# EAGLE design TopPCB (EAGLE 6.3)
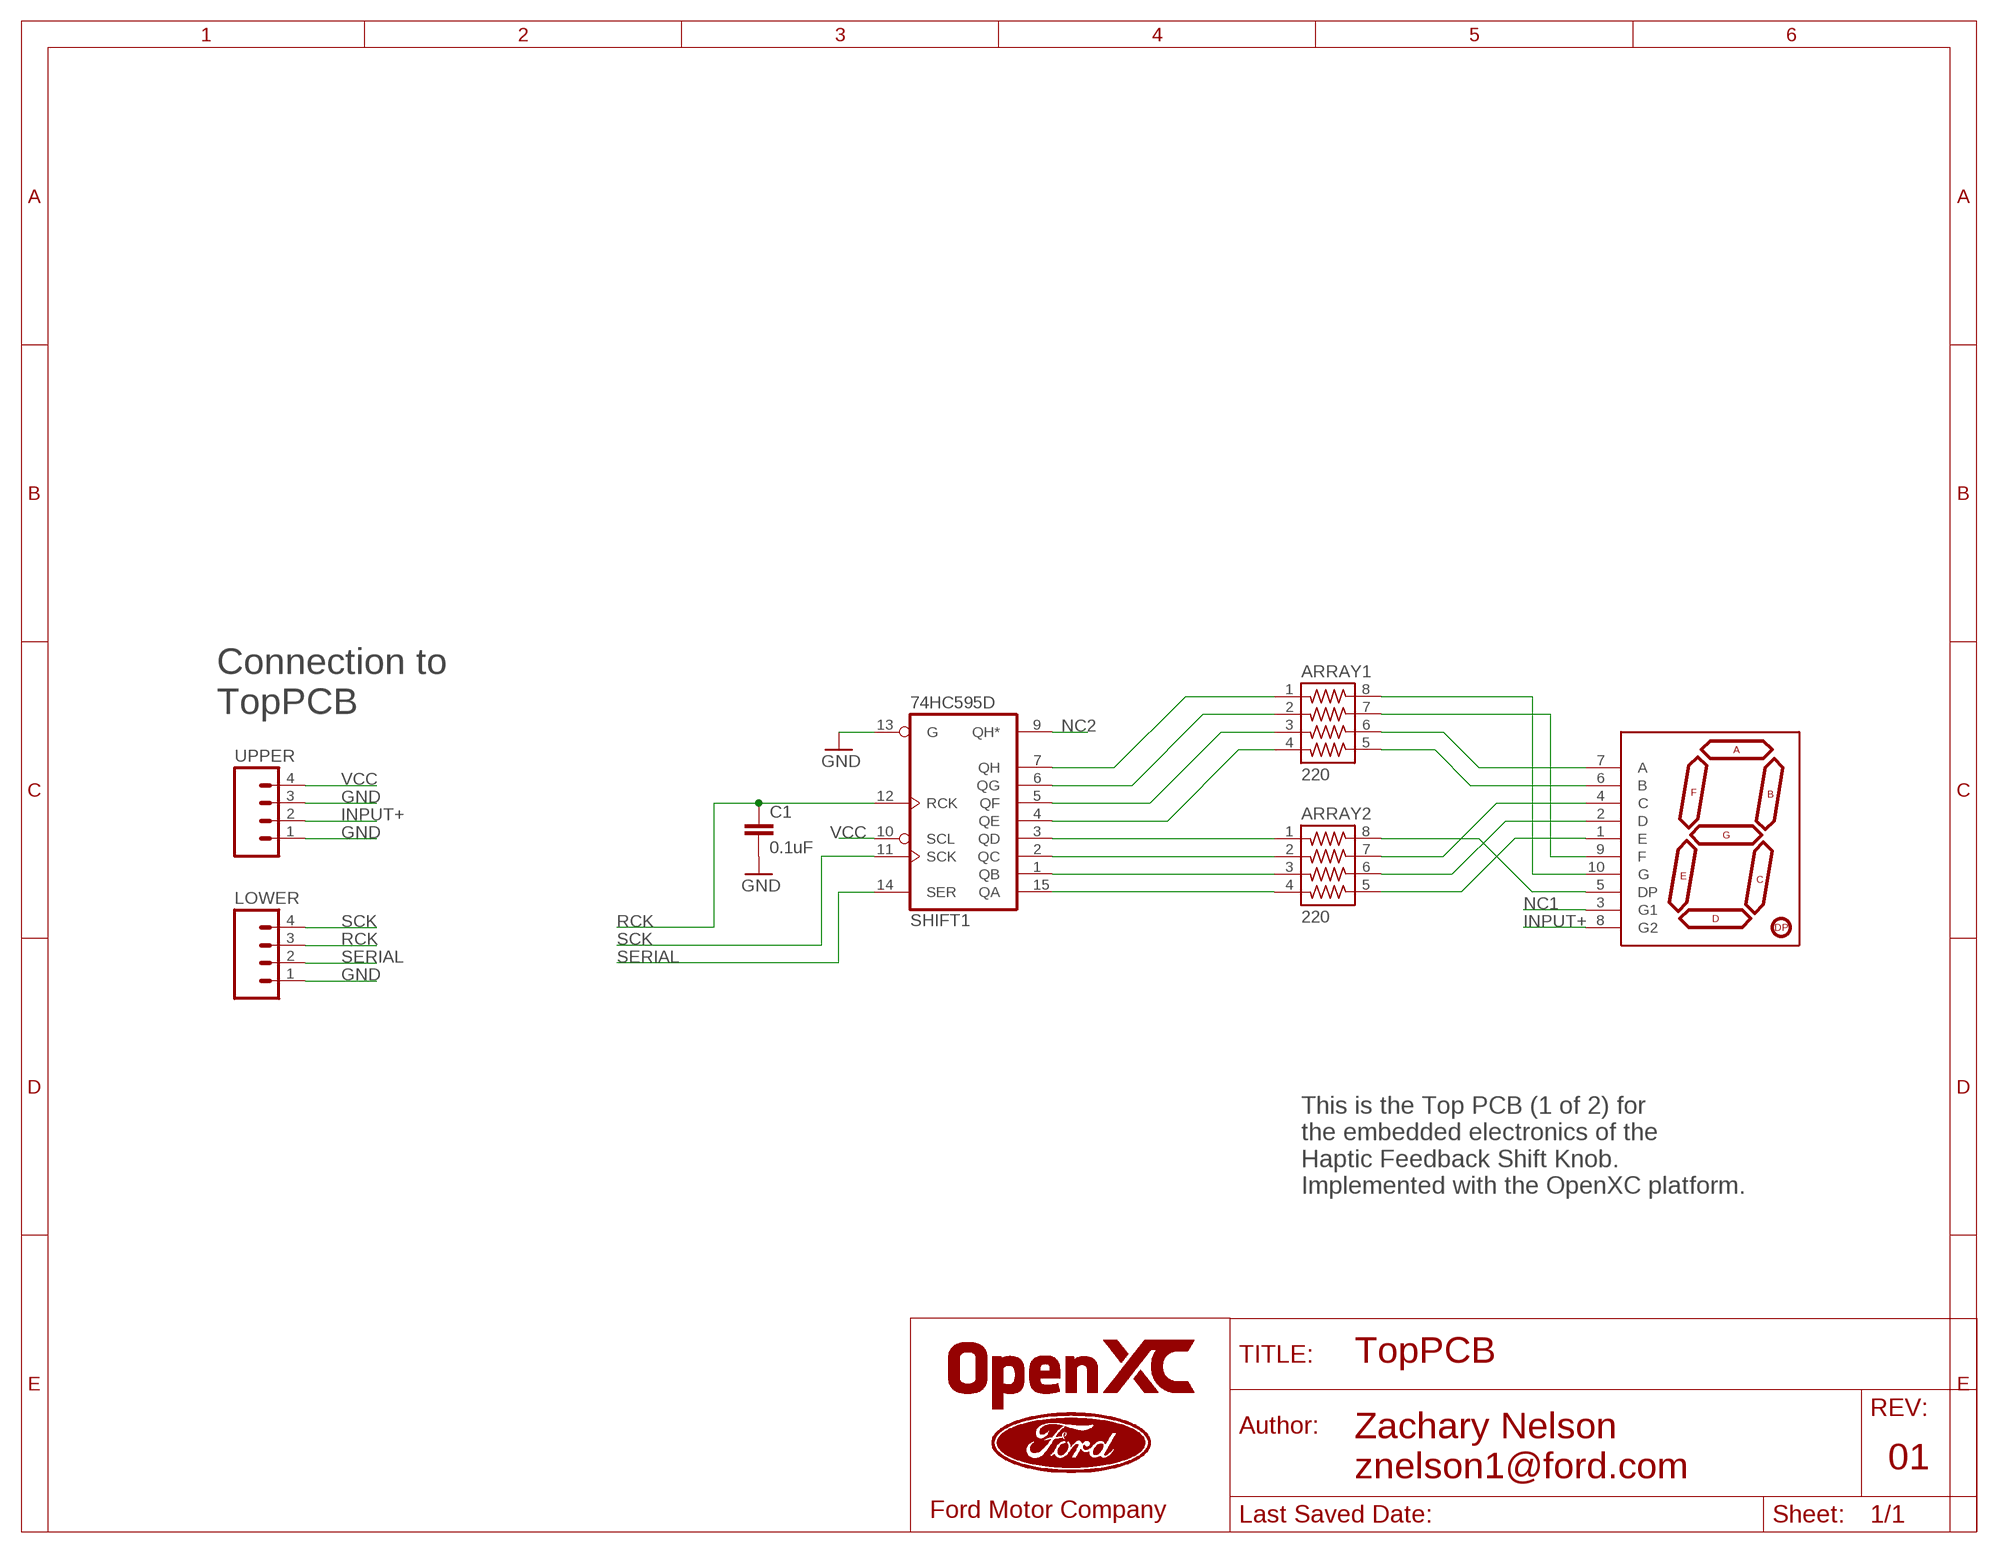
[diagram p0: schematic, sheet 1]

## Parts
7SEGMENT  7-SEGMENT-DISPLAY-1"-RED  [7-SEGMENT-1"PTH]
ARRAY1  220  744-8  [744-8]
ARRAY2  220  744-8  [744-8]
C1  0.1uF  CAP0402-CAP  [0402-CAP]
LOWER  M04PTH  [1X04]
SHIFT1  74HC595D  [SO16]
UPPER  M04PTH  [1X04]

## Nets
GND: C1.2 LOWER.1 SHIFT1.13(G) UPPER.1 UPPER.3
INPUT+: 7SEGMENT.8(G2) UPPER.2
N$1: 7SEGMENT.5(DP) ARRAY2.8
N$2: ARRAY2.3 SHIFT1.1(QB)
N$3: 7SEGMENT.1(E) ARRAY2.5
N$4: ARRAY2.2 SHIFT1.2(QC)
N$5: ARRAY2.1 SHIFT1.3(QD)
N$7: 7SEGMENT.4(C) ARRAY2.7
N$8: 7SEGMENT.6(B) ARRAY1.5
N$9: ARRAY2.4 SHIFT1.15(QA)
N$10: ARRAY1.4 SHIFT1.4(QE)
N$11: ARRAY1.3 SHIFT1.5(QF)
N$12: ARRAY1.2 SHIFT1.6(QG)
N$13: ARRAY1.1 SHIFT1.7(QH)
N$14: 7SEGMENT.7(A) ARRAY1.6
N$15: 7SEGMENT.9(F) ARRAY1.7
N$16: 7SEGMENT.10(G) ARRAY1.8
N$19: 7SEGMENT.2(D) ARRAY2.6
NC1: 7SEGMENT.3(G1)
NC2: SHIFT1.9(QH*)
RCK: C1.1 LOWER.3 SHIFT1.12(RCK)
SCK: LOWER.4 SHIFT1.11(SCK)
SERIAL: LOWER.2 SHIFT1.14(SER)
VCC: SHIFT1.10(SCL) UPPER.4

## Notes on the sheet
- Connection to 
  TopPCB
- This is the Top PCB (1 of 2) for 
  the embedded electronics of the 
  Haptic Feedback Shift Knob. 
  Implemented with the OpenXC platform.
- 01
- Zachary Nelson
  znelson1@ford.com

## Power pins joined to a net without a drawn wire
GND: SHIFT1.8(GND)
VCC: SHIFT1.16(VCC)

## Library data of the parts
7SEGMENT = SparkFun-Displays:7-SEGMENT-DISPLAY-1"-RED: 7-Segment Display 1" Red (COM-08546)
ARRAY1 ARRAY2 = resistor-array:744-8: CTS 744 Series 4 Resistors, 8 Terminations
C1 = SparkFun-Capacitors:CAP: Capacitor Standard 0603 ceramic capacitor, and 0.1" leaded capacitor.
LOWER UPPER = SparkFun-Connectors:M04: Header 4 Standard 4-pin 0.1" header. Use with straight break away headers (SKU : PRT-00116), right angle break away headers (PRT-00553), swiss pins (PRT-00743), machine pins (PRT-00117), and female headers (PRT-00115). Molex polarized connector foot print use with SKU : PRT-08231 with associated crimp pins and housings. 1MM SMD Version SKU: PRT-10208
SHIFT1 = 74xx-eu:74*595: 8-bit SHIFT REGISTER, output latch

## Board
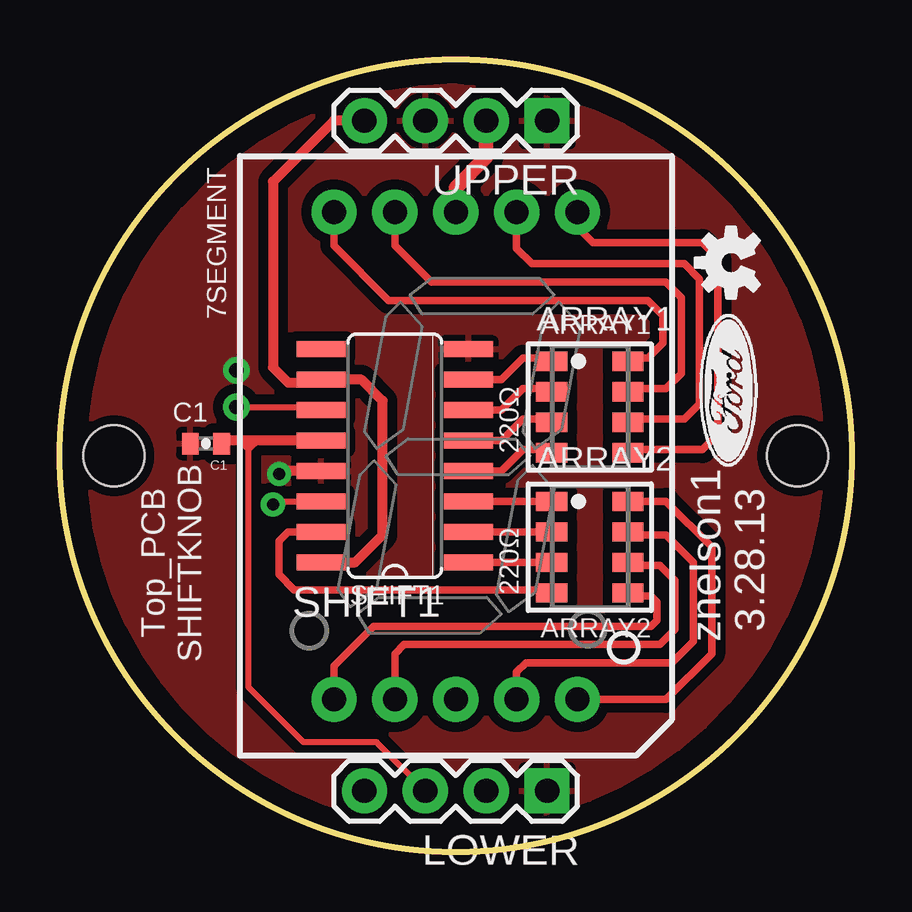
[diagram p1: board, top side]
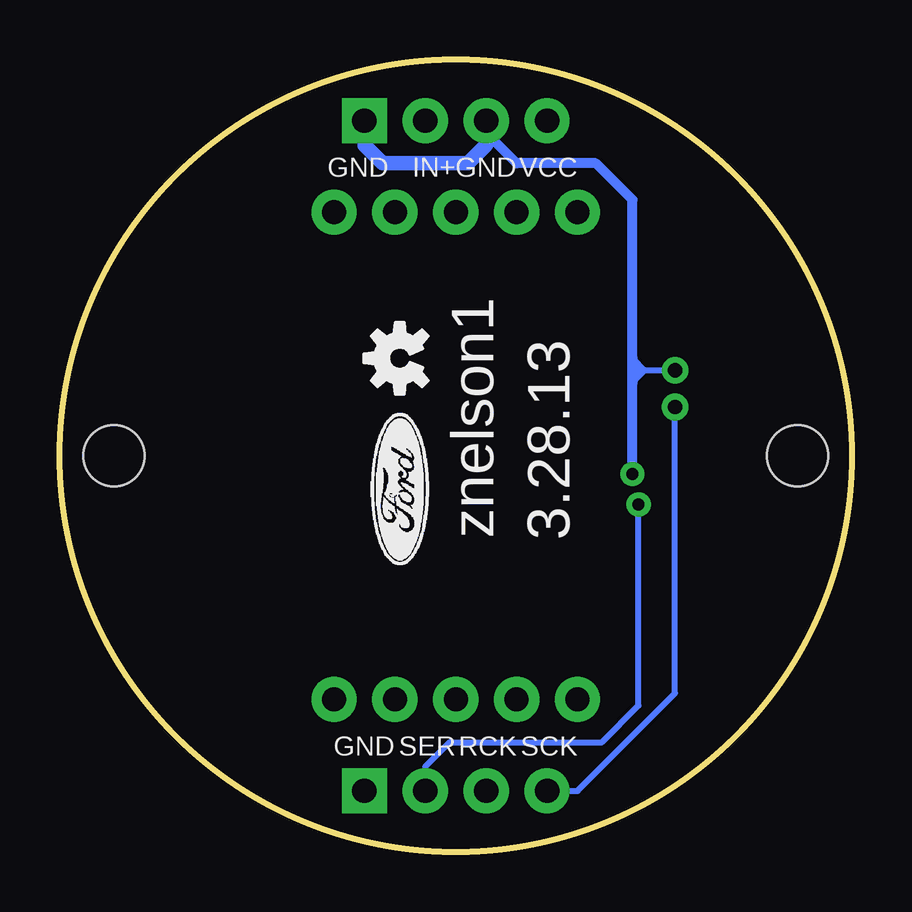
[diagram p2: board, bottom side, seen from below]

Size 33 x 33 mm. Coordinates in mm from the lower left corner, seen from the top.
Outline: circle at 16.5,16.5 radius 16.5
Copper layers (1*16): Top 0.035mm / dielectric 1.5mm / Bottom 0.035mm
Design rules "SparkFun": minimum track width 8mil, minimum drill 20mil, track to track 8mil, track to pad 8mil, pad to pad 8mil, via to via 8mil, smd to smd 8mil, copper to edge 10mil, drill to drill 8mil, minimum pad ring 12mil, minimum via ring 10mil, stop-mask expansion 4mil, vias tented up to drill 25mil, thermal gap 10mil
Holes 2.54 mm at 2.25,16.5 30.75,16.5

### Footprints (pad centres in the part's own frame; a part is rotated, then mirrored left to right if it is on the bottom)
7-SEGMENT-1"PTH = drill 1 pad 1.88: 1 -5.08,-10.16; 2 -2.54,-10.16; 3 0,-10.16; 4 2.54,-10.16; 5 5.08,-10.16; 6 5.08,10.16; 7 2.54,10.16; 8 0,10.16; 9 -2.54,10.16; 10 -5.08,10.16
744-8 = smd 0.8 x 1.3: 1 -1.905,-1.587; 2 -0.635,-1.587; 3 0.635,-1.587; 4 1.905,-1.587; 5 1.905,1.587; 6 0.635,1.587; 7 -0.635,1.587; 8 -1.905,1.587
0402-CAP = smd 0.7 x 0.9: 1 -0.65,0; 2 0.65,0
1X04 = drill 1.016 pad 1.88 square: 1 0,0 | drill 1.016 pad 1.88: 2 2.54,0; 3 5.08,0; 4 7.62,0
SO16 = smd 0.66 x 2.032: 1 -4.445,-3.073; 2 -3.175,-3.073; 3 -1.905,-3.073; 4 -0.635,-3.073; 5 0.635,-3.073; 6 1.905,-3.073; 7 3.175,-3.073; 8 4.445,-3.073; 9 4.445,3.073; 10 3.175,3.073; 11 1.905,3.073; 12 0.635,3.073; 13 -0.635,3.073; 14 -1.905,3.073; 15 -3.175,3.073; 16 -4.445,3.073

### Placement (x,y rotation side)
7SEGMENT  16.5,16.5 0 top
ARRAY1  22.09,18.53 270 top
ARRAY2  22.09,12.69 270 top
C1  6.09,17.01 180 top
LOWER  20.31,2.53 180 top
SHIFT1  13.96,16.5 90 top
U$1  OSHW-LOGOS  [OSHW-LOGO-S]  27.98,24.55 90 top
U$2  OSHW-LOGOS  [OSHW-LOGO-S]  18.84,20.56 90 bottom
U$3  [DOCFIELD]  -54.62,-53.35 0 top  (outside the outline)
UPPER  20.31,30.47 180 top

### Tracks (layer width: path | path; a pad name or v marks a point on that pad's centre or on a via)
GND  (via drill 0.51, 0.6)
  Top 0.406: SHIFT1.13 9.13,15.86 v9.13,15.74 9.02,15.63
  Bottom 0.254: v7.36,20.06 8.63,20.06 | 8.63,20.06 9.13,20.06 | 8.63,20.06 9.13,19.55 | 8.63,20.06 9.13,20.56
  Bottom 0.406: v9.13,15.74 9.13,19.55 9.13,20.06 9.13,20.56 9.13,27.17 10.66,28.69 13.96,28.69 15.23,29.96
  Bottom 0.61: UPPER.3 15.23,29.96 15.23,29.45 15.99,28.69 19.55,28.69 20.31,29.45 UPPER.1
  pour Top (isolate 0.406): 1.26,16.32 arc-90 16.42,31.92 16.78,31.87 arc-90 31.74,16.7 arc-90 16.5,1.08 arc-91
INPUT+
  Top 0.61: 7SEGMENT.8 16.5,27.68 17.77,28.95 UPPER.2
N$1
  Top 0.305: ARRAY2.8 25.26,14.59 27.17,12.69 27.17,8.25 25.26,6.34 7SEGMENT.5
N$2
  Top 0.305: SHIFT1.1 ARRAY2.3
N$3
  Top 0.305: 7SEGMENT.1 11.42,7.74 13.07,9.39 24.63,9.39 24.88,9.64 24.88,10.4 24.63,10.66 23.93,10.66 ARRAY2.5
N$4
  Top 0.305: ARRAY2.2 SHIFT1.2
N$5
  Top 0.305: SHIFT1.3 ARRAY2.1 20.63,14.72
N$7
  Top 0.305: 7SEGMENT.4 19.04,7.48 19.42,7.86 25.52,7.86 26.41,8.75 26.41,12.05 25.26,13.2 23.68,13.2 ARRAY2.7
N$8
  Top 0.254: 23.93,16.75 ARRAY1.5
  Top 0.305: 7SEGMENT.6 21.58,26.02 22.21,25.39 26.79,25.39 27.42,24.75 27.42,17.39 26.79,16.75 23.93,16.75
N$9
  Top 0.305: SHIFT1.15 9.52,13.32 9.13,12.94 9.13,11.55 9.77,10.91 20.63,10.91 ARRAY2.4
N$10
  Top 0.305: SHIFT1.4 18.41,15.86 19.29,16.75 20.63,16.75
  Top 0.406: 20.63,16.75 ARRAY1.4
N$11
  Top 0.254: 20.63,18.02 ARRAY1.3
  Top 0.305: SHIFT1.5 18.41,17.14 19.29,18.02 20.63,18.02
N$12
  Top 0.254: 20.63,19.29 ARRAY1.2
  Top 0.305: SHIFT1.6 18.41,18.41 19.29,19.29 20.63,19.29
N$13
  Top 0.254: 20.63,20.56 ARRAY1.1
  Top 0.305: SHIFT1.7 18.41,19.68 19.29,20.56 20.63,20.56
N$14
  Top 0.254: 23.93,18.02 ARRAY1.6
  Top 0.305: 7SEGMENT.7 19.04,25.14 19.68,24.5 26.02,24.5 26.66,23.87 26.66,18.66 26.02,18.02 23.93,18.02
N$15
  Top 0.254: 23.93,19.29 ARRAY1.7
  Top 0.305: 7SEGMENT.9 13.96,25.26 15.48,23.74 25.26,23.74 25.9,23.1 25.9,19.93 25.26,19.29 23.93,19.29
N$16
  Top 0.254: 23.93,20.56 ARRAY1.8
  Top 0.305: 23.93,20.56 24.5,20.56 25.14,21.2 25.14,22.34 24.5,22.98 13.71,22.98 11.42,25.26 7SEGMENT.10
N$19
  Top 0.305: 7SEGMENT.2 13.96,8.25 14.34,8.63 25.01,8.63 25.64,9.26 25.64,11.29 25.01,11.93 23.93,11.93 ARRAY2.6
RCK
  Top 0.254: 6.86,17.14 C1.1 6.59,16.87 | LOWER.3 13.2,4.56 10.15,4.56 7.86,6.85 7.86,16.75 | 7.86,16.75 7.86,17.14 | 7.86,16.75 8.12,17.01 | 7.86,16.75 7.61,17.01
  Top 0.406: SHIFT1.12 7.86,17.14 6.74,17.14 C1.1
SCK  (via drill 0.6)
  Top 0.254: v7.36,18.53 10.76,18.53 SHIFT1.11
  Bottom 0.254: LOWER.4 11.42,2.53 7.36,6.59 v7.36,18.53
SERIAL  (via drill 0.51)
  Top 0.254: v8.88,14.47 9.01,14.59 SHIFT1.14
  Bottom 0.254: LOWER.2 17.77,3.55 16.75,4.56 10.4,4.56 8.88,6.09 v8.88,14.47
VCC
  Top 0.406: SHIFT1.16 12.31,12.05 13.45,13.2 13.45,18.79 12.56,19.68 SHIFT1.10 10.89,19.55 9.52,19.55 8.88,20.18 8.88,27.93 11.42,30.47 UPPER.4

### Text on the board
tPlace: 7SEGMENT | ARRAY1 | C1 | 220Ω | znelson1 | 3.28.13 | Top_PCB / SHIFTKNOB | 220Ω | SHIFT1 | ARRAY2
bPlace: VCC | GND | IN+ | GND | znelson1 | 3.28.13 | SCK | RCK | SER | GND
Document: 02 | Zachary Nelson / znelson1@ford.com